# EAGLE design dual power supply (EAGLE 9.6.2)
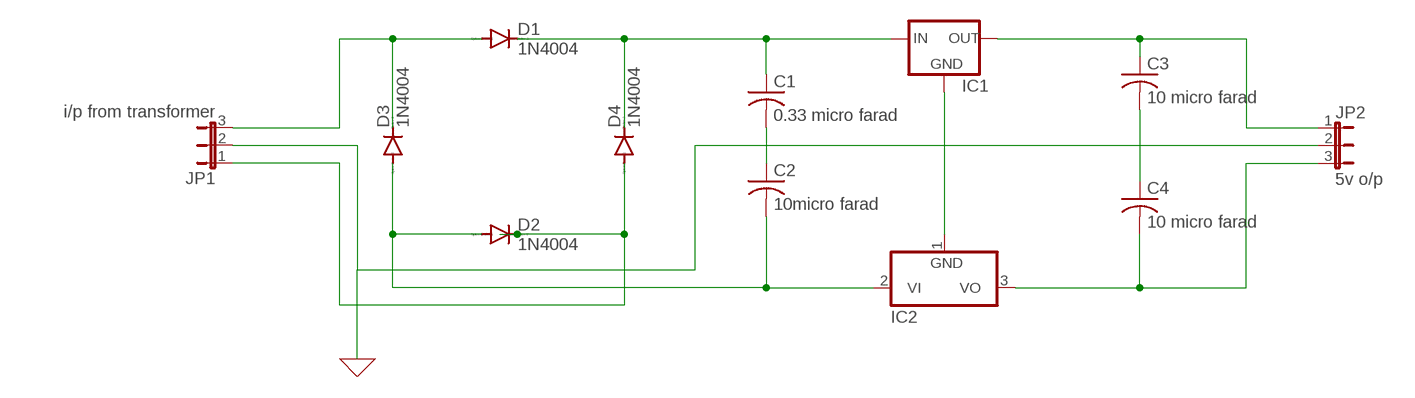
[diagram p0: schematic, sheet 1]

## Parts
C1  0.33 micro farad  C-US025-025X050  [C025-025X050]
C2  10micro farad  C-US025-025X050  [C025-025X050]
C3  10 micro farad  C-US025-025X050  [C025-025X050]
C4  10 micro farad  C-US025-025X050  [C025-025X050]
D1  1N4004  [DO41-10]
D2  1N4004  [DO41-10]
D3  1N4004  [DO41-10]
D4  1N4004  [DO41-10]
IC1  78MXXS  [78MXXS]
IC2  7905L  [TO92]
JP1  i/p from transformer  JP2E  [JP2]
JP2  5v o/p  JP2E  [JP2]

## Nets
0: JP1.2 JP2.2 ; supply symbol labelled GND
N$1: D1.A D3.C JP1.3
N$2: C1.1 D1.C D4.C IC1.IN
N$3: D2.C D4.A JP1.1
N$5: C1.2 C2.1
N$6: C3.2 C4.1
N$7: IC1.GND IC2.1(GND)
N$8: C2.2 D2.A D3.A IC2.2(VI)
N$9: C3.1 IC1.OUT JP2.1
N$10: C4.2 IC2.3(VO) JP2.3

## Library data of the parts
C1-C4 = rcl:C-US: CAPACITOR, American symbol; SPICEPREFIX: C
D1-D4 = diode:1N4004: DIODE general purpose rectifier, 1 A
IC1 = v-reg:78MXXS: VOLTAGE REGULATOR
IC2 = linear:79*: Negative VOLTAGE REGULATOR
JP1 JP2 = jumper:JP2E: JUMPER

## Board
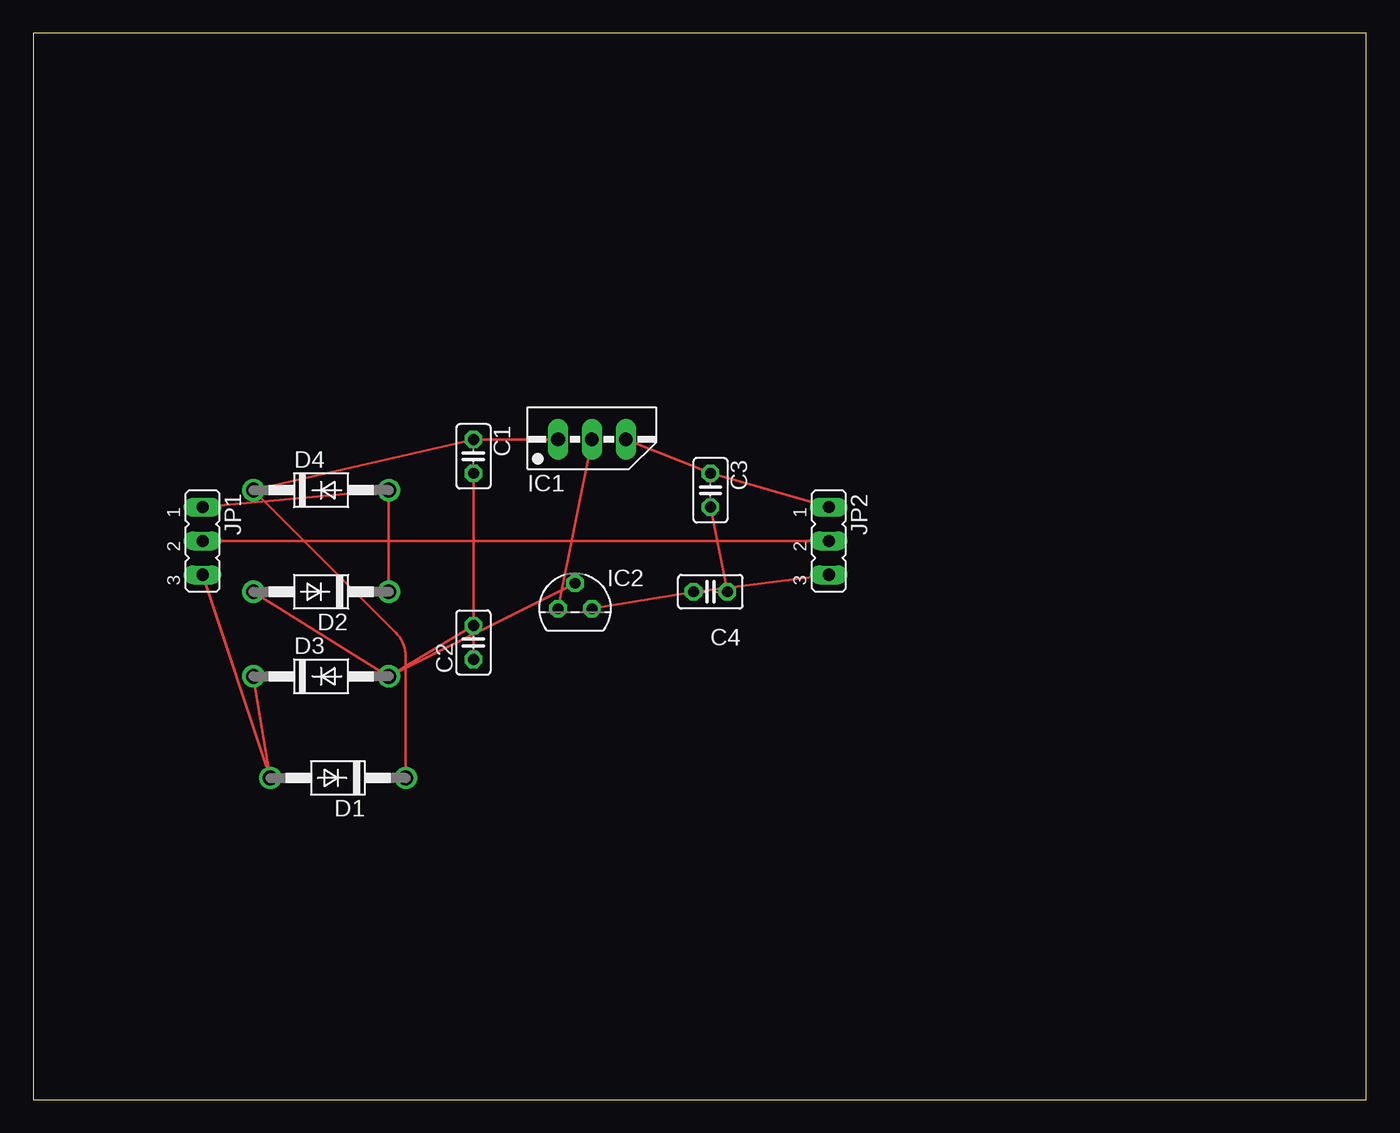
[diagram p1: board, top side]
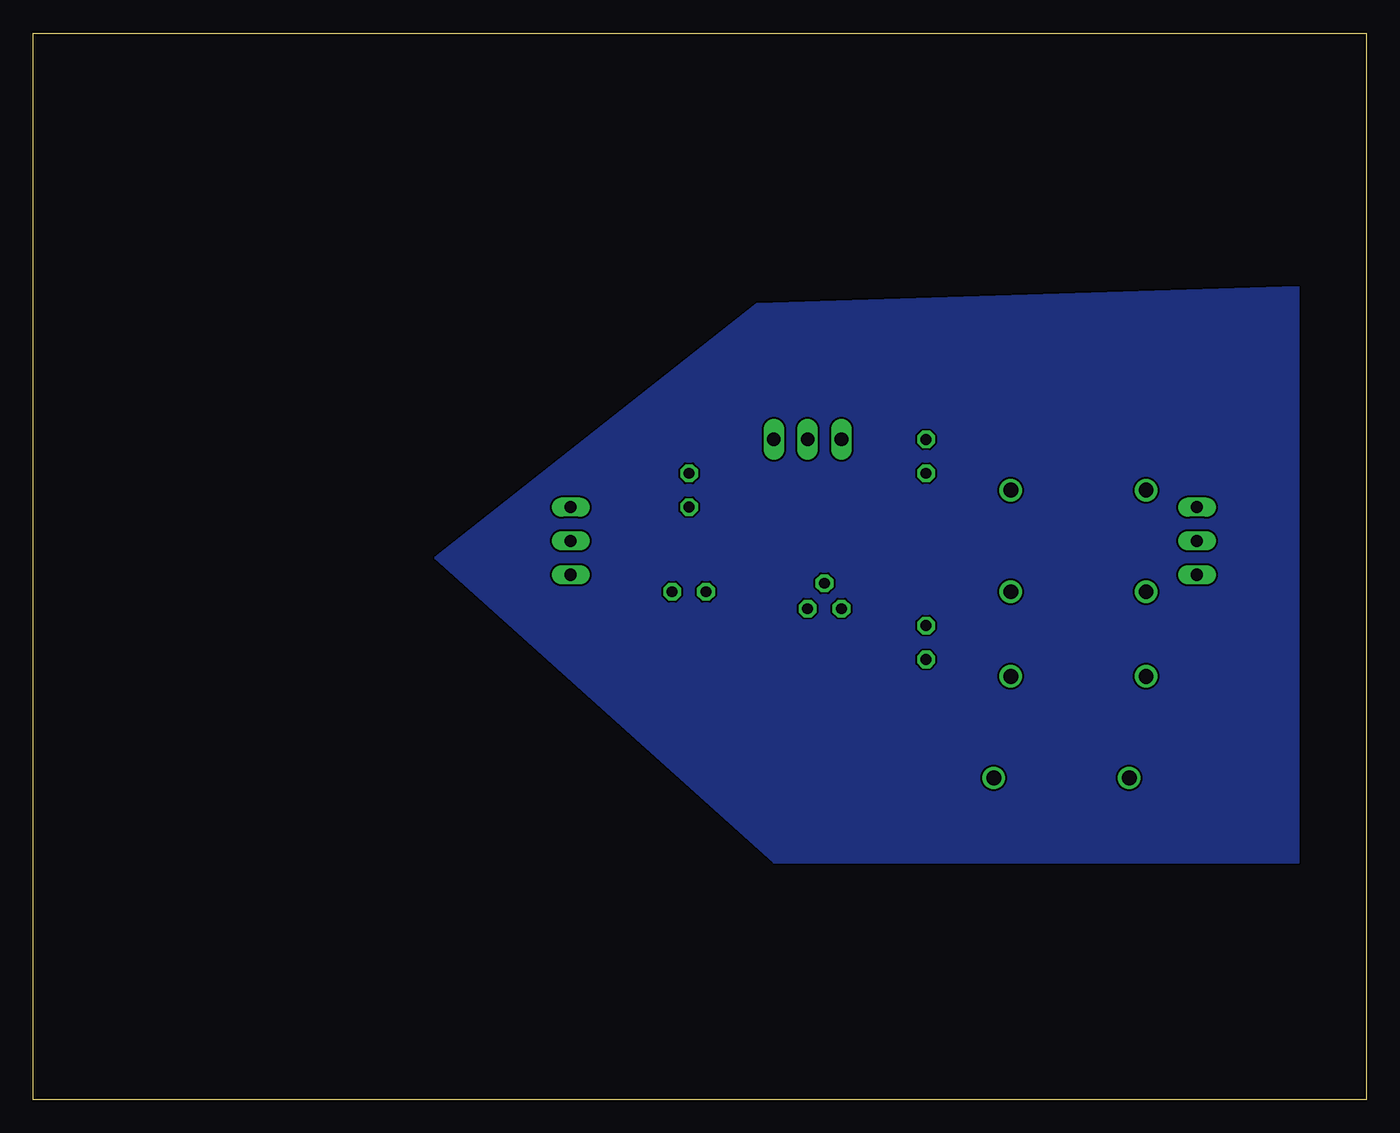
[diagram p2: board, bottom side, seen from below]

Size 100 x 80 mm. Coordinates in mm from the lower left corner, seen from the top.
Outline: 0,0 100,0 100,80 0,80 0,0
Copper layers (1*16): Top 0.035mm / dielectric 1.5mm / Bottom 0.035mm
Design rules "default": minimum track width 6mil, minimum drill 0.35mm, track to track 6mil, track to pad 6mil, pad to pad 6mil, via to via 6mil, smd to smd 6mil, copper to edge 40mil, drill to drill 6mil, minimum pad ring 10mil, minimum via ring 8mil, stop-mask expansion 4mil, vias tented up to drill 0mil, thermal gap 10mil

### Footprints (pad centres in the part's own frame; a part is rotated, then mirrored left to right if it is on the bottom)
C025-025X050 = drill 0.813 octagon: 1 -1.27,0; 2 1.27,0
DO41-10 = drill 1.118: A 5.08,0; C -5.08,0
78MXXS = drill 1.016 long: GND 0,-2.54; IN -2.54,-2.54; OUT 2.54,-2.54
TO92 = drill 0.813 octagon: 1 -1.27,0; 2 0,1.905; 3 1.27,0
JP2 = drill 0.914 long: 1 -2.54,0; 2 0,0; 3 2.54,0

### Placement (x,y rotation side)
C1  33.02,48.26 270 top
C2  33.02,34.29 90 top
C3  50.8,45.72 270 top
C4  50.8,38.1 180 top
D1  22.86,24.13 180 top
D2  21.59,38.1 180 top
D3  21.59,31.75 0 top
D4  21.59,45.72 0 top
IC1  41.91,52.07 0 top
IC2  40.64,36.83 0 top
JP1  12.7,41.91 270 top
JP2  59.69,41.91 270 top

### Tracks (layer width: path | path; a pad name or v marks a point on that pad's centre or on a via)
0
  Top 0.203: JP2.2 JP1.2
H
  pour Bottom: 5.08,58.42 5.08,17.78 44.45,17.78 69.85,40.64 45.72,59.69 5.08,60.96
N$1
  Top 0.203: JP1.3 D1.A D3.C
N$2
  Top 0.203: D1.C 27.94,33.24 arc45 27.2,35.03 D4.C C1.1 IC1.IN
N$3
  Top 0.203: JP1.1 D4.A D2.C
N$5
  Top 0.203: C1.2 C2.1
N$6
  Top 0.203: C3.2 C4.1
N$7
  Top 0.203: IC1.GND IC2.1
N$8
  Top 0.203: D3.A D2.A | D3.A IC2.2 | D3.A C2.2
N$9
  Top 0.203: IC1.OUT C3.1 JP2.1
N$10
  Top 0.203: IC2.3 C4.2 JP2.3